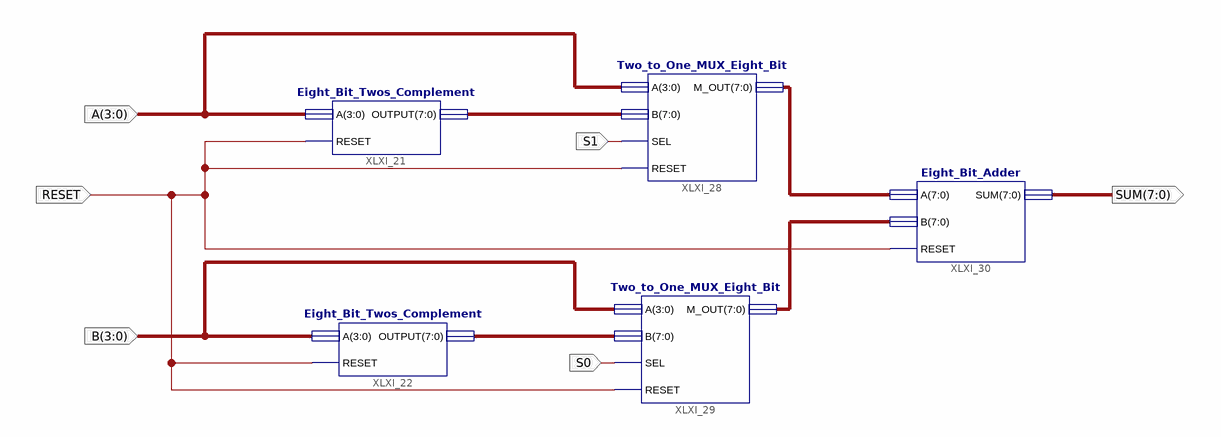
[diagram p0: schematic sheet 1]
// Xilinx ISE schematic Adder_Calculator.sch (spartan6) as structural Verilog: 5 symbols, 6 ports
module Adder_Calculator (
  input  [3:0] A,
  input  [3:0] B,
  input  S1,
  input  S0,
  input  RESET,
  output [7:0] SUM
);

  wire [7:0] XLXN_19, XLXN_20, XLXN_27, XLXN_28;

  Eight_Bit_Twos_Complement XLXI_21 (.A(A), .OUTPUT(XLXN_20), .RESET(RESET));
  Eight_Bit_Twos_Complement XLXI_22 (.A(B), .OUTPUT(XLXN_19), .RESET(RESET));
  Two_to_One_MUX_Eight_Bit XLXI_28 (.A(A), .B(XLXN_20), .M_OUT(XLXN_27), .RESET(RESET), .SEL(S1));
  Two_to_One_MUX_Eight_Bit XLXI_29 (.A(B), .B(XLXN_19), .M_OUT(XLXN_28), .RESET(RESET), .SEL(S0));
  Eight_Bit_Adder XLXI_30 (.A(XLXN_27), .B(XLXN_28), .RESET(RESET), .SUM(SUM));
endmodule
